# EasyEDA Pro project ProPrj_ftdi-jtag-xilinx-14pin_2025-03-20_v2.1.epro, board PCB1
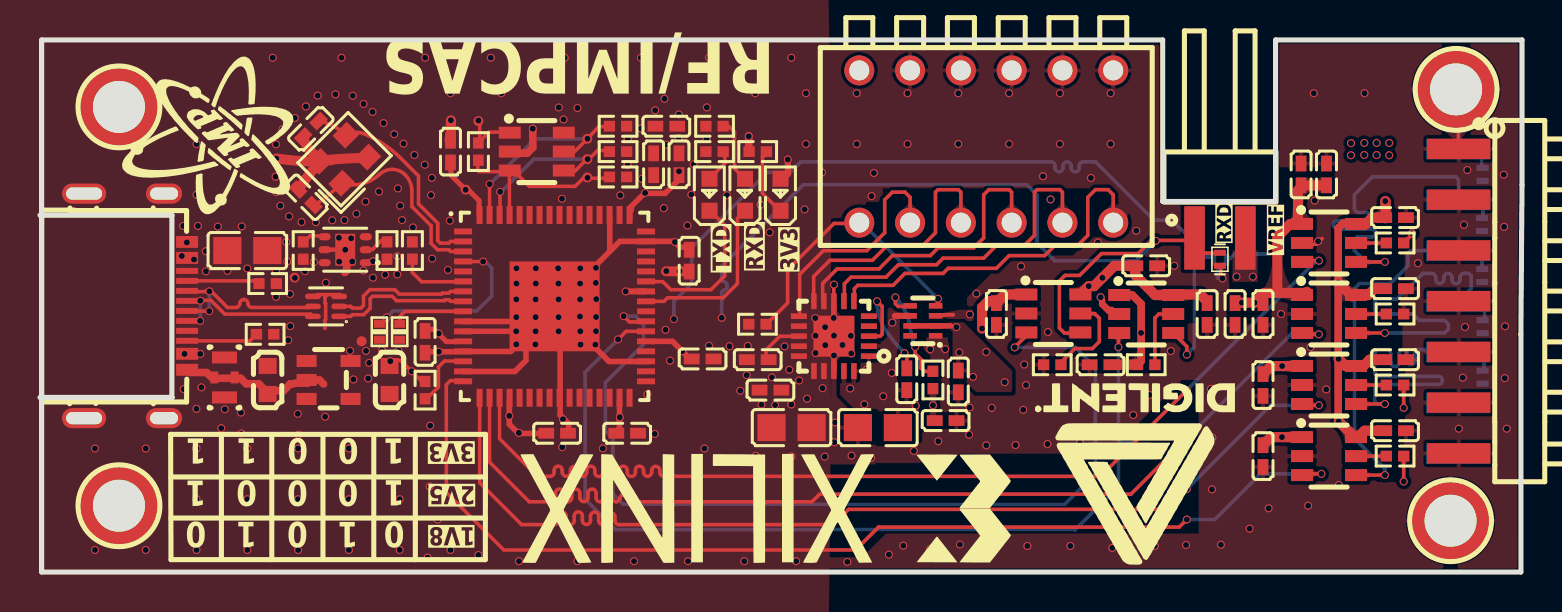
[diagram p4: board, top side]
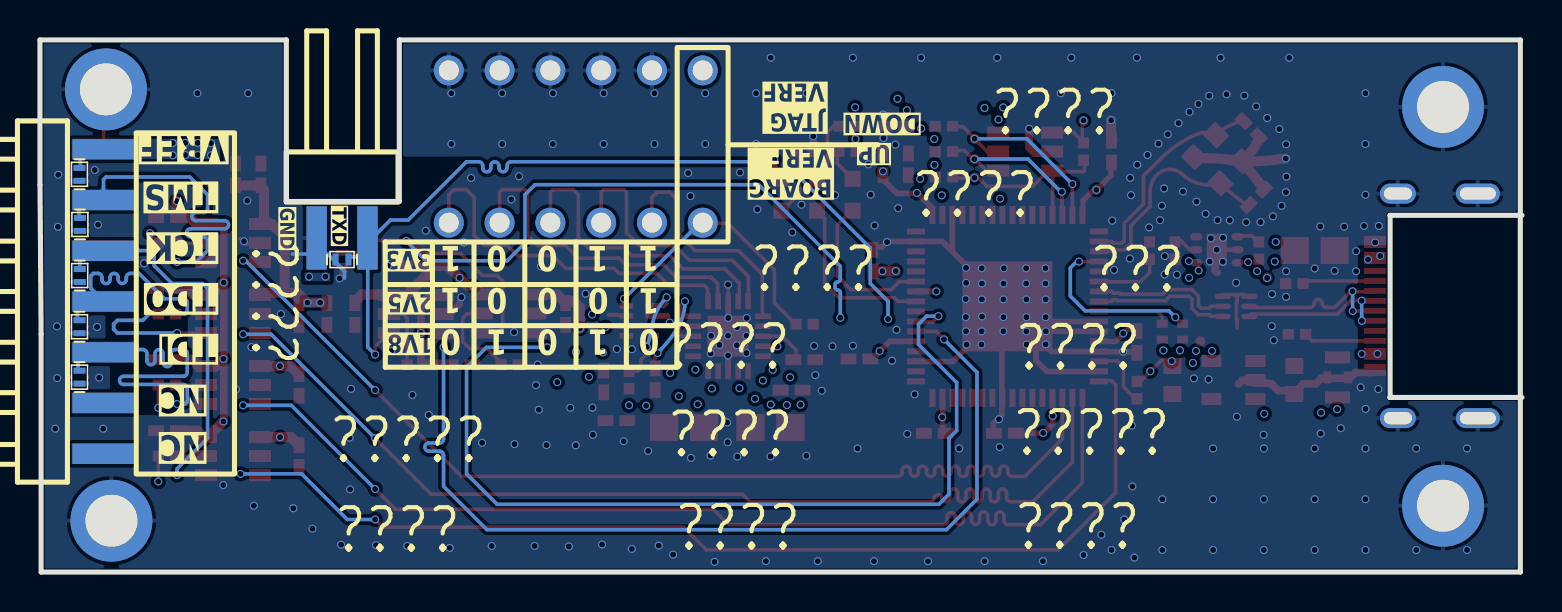
[diagram p5: board, bottom side, seen from below]

Outline 74.12 x 26.63 mm; copper layers: Top Layer, Inner1, Inner2, Bottom Layer. Coordinates in mm from the lower left corner of the outline.
Outline path: 0.08,26.63 56.15,26.63 56.15,18.55 61.8,18.55 61.8,26.63 74.12,26.63 74.12,19.38 74.07,11.9 74.07,0 0.08,0 0.08,26.63
Stack: Top Layer 0.035mm 外层铜厚1oz / Dielectric1 0.2104mm 7628 RC49% 8.6mil / Inner1 0.0152mm 内层铜厚 / Dielectric2 1.065mm 1.1mm H/HOZ Copper / Inner2 0.0152mm 内层铜厚 / Dielectric3 0.2104mm 7628 RC49% 8.6mil / Bottom Layer 0.035mm 外层铜厚1oz

## Design rules (mm)
net USB_DP_O: USB2
net USB_DN_O: USB2
net USB_DN: USB1
net USB_DP: USB1
net OSCO: OSC
net OSCI: OSC
template: 自定义配置
spacing copperThickness1oz (default): track to track 0.102, other pairs 0.152 to 0.3
spacing copperThickness2oz: track to track 0.203, other pairs 0.152 to 0.3
track width copperThickness1oz (default): min 0.127, default 0.178, max 2.54
track width copperThickness2oz: min 0.203, default 0.254, max 2.54
differential pair differentialPair (default): width min 0.127, default 0.254, max 2.54; gap min 0.152, default 0.152
via viaSize (default): diameter min 0.4, default 0.4, max 10; hole min 0.3, default 0.3, max 6.299

## Placement (name value [footprint] x y rotation side)
C1  100nF  [C0402]  25.87 6.95 180 top
C2  100nF  [C0402]  29.37 6.95 180 top
C3  100nF  [C0402]  32.47 15.58 270 top
C4  100nF  [C0402]  30.69 20.41 270 top
C5  100nF  [C0402]  59.77 12.92 90 top
C6  100nF  [C0402]  64.35 19.9 270 top
C7  100nF  [C0402]  55.33 15.33 180 top
C8  100nF  [C0402]  47.84 12.92 90 top
C9  100nF  [C0402]  31.96 20.41 270 top
C10  100nF  [C0402]  33.14 10.67 180 top
C11  100nF  [C0402]  20.53 21.04 270 top
C12  10uF  [C0603]  11.39 9.61 270 top
C13  4.7uF  [C0402]  19.26 11.52 270 top
C14  100nF  [C0402]  31.33 22.31 180 top
C15  NFM21PC104R1E3D  [CAP-SMD_4P-L2.0-W1.25]  9.23 9.74 270 top
C16  10uF  [C0603]  17.48 9.61 90 top
C17  22uF  [C0805]  10.37 16.09 0 top
C23  22uF  [C0805]  37.59 7.23 180 top
C24  100nF  [C0402]  36.53 9.11 180 top
C25  22uF  [C0805]  41.91 7.23 180 top
C26  100nF  [C0402]  61.17 12.92 90 top
C27  100nF  [C0402]  45.3 7.58 180 top
C28  100nF  [C0402]  67.78 17.74 180 top
C29  100nF  [C0402]  45.93 9.54 90 top
C30  10nF  [C0402]  35.9 10.63 180 top
C31  10nF  [C0402]  43.35 9.65 90 top
C32  100nF  [C0402]  61.17 9.36 90 top
C33  100nF  [C0402]  58.38 12.92 90 top
C34  100nF  [C0402]  53.04 10.38 0 top
C35  100nF  [C0402]  67.78 7.07 180 top
C36  100nF  [C0402]  63.08 19.9 270 top
C37  100nF  [C0402]  67.78 14.19 180 top
C38  100nF  [C0402]  61.17 5.8 90 top
C39  100nF  [C0402]  67.78 10.63 180 top
C40  10pF  [C0402]  13.55 22.19 45 top
C41  10pF  [C0402]  13.29 18.76 315 top
D1  H5VL10B  [SOD-882_L1.0-W0.6-BI]  72.15 19.91 90 bottom
D2  H5VL10B  [SOD-882_L1.0-W0.6-BI]  72.13 17.4 90 bottom
D3  H5VL10B  [SOD-882_L1.0-W0.6-BI]  72.14 14.84 90 bottom
D4  H5VL10B  [SOD-882_L1.0-W0.6-BI]  72.15 12.28 90 bottom
D5  H5VL10B  [SOD-882_L1.0-W0.6-BI]  72.15 9.76 90 bottom
D6  H5VL10B  [SOD-882_L1.0-W0.6-BI]  59.02 15.64 180 bottom
D7  H5VL10B  [SOD-882_L1.0-W0.6-BI]  59.02 15.65 90 top
L1  ECMF02-2AMX6  [UFQFN-6_L1.7-W1.5]  14.31 13.3 180 top
L2  BLM15PD121SN1D  [L0402]  17.99 12.03 270 top
L3  BLM15PD121SN1D  [L0402]  16.98 12.03 90 top
LED1  NCD0603Y1  [LED0603-RD]  37.04 18.88 90 top
LED2  NCD0603Y1  [LED0603-RD]  35.26 18.88 90 top
LED3  NCD0603Y1  [LED0603-RD]  33.49 18.88 90 top
R1  5.1kΩ  [R0402]  11.26 11.9 180 top
R2  5.1kΩ  [R0402]  11.39 14.44 180 top
R3  10kΩ  [R0402]  35.9 21.04 0 top
R4  10kΩ  [R0402]  33.74 22.31 180 top
R6  56kΩ  [R0402]  17.36 16.09 270 top
R10  10kΩ  [R0402]  28.91 22.31 180 top
R11  10kΩ  [R0402]  28.91 21.04 180 top
R12  200kΩ  [R0402]  13.17 16.09 270 top
R13  10kΩ  [R0402]  33.74 21.04 0 top
R14  12kΩ  [R0402]  18.63 16.09 270 top
R15  1kΩ  [R0402]  19.26 9.11 270 top
R18  2kΩ  [R0402]  21.93 21.04 270 top
R19  10kΩ  [R0402]  28.91 19.77 0 top
R20  10kΩ  [R0402]  44.66 9.61 90 top
R21  10kΩ  [R0402]  35.88 12.4 0 top
R22  10kΩ  [R0402]  67.78 5.8 0 top
R23  10kΩ  [R0402]  67.78 9.36 0 top
R24  10kΩ  [R0402]  67.78 12.92 0 top
R25  10kΩ  [R0402]  67.78 16.47 0 top
R26  10kΩ  [R0402]  55.33 10.38 180 top
R27  10kΩ  [R0402]  50.63 10.38 180 top
SW1  SMQP-06B-TP  [SW-TH_12P-P2.54_SMQP-06B-TP]  47.33 21.3 180 top
TP1  -  [Test-Point-0.5mm]  21.29 19.14 0 top
TP2  -  [Test-Point-0.5mm]  12.73 14.74 270 top
TP3  -  [Test-Point-0.5mm]  16.09 11.55 0 top
TP4  -  [Test-Point-0.5mm]  27.37 21.69 0 top
TP5  -  [Test-Point-0.5mm]  27.37 20.67 0 top
TP6  -  [Test-Point-0.5mm]  21.93 22.57 0 top
TP9  -  [Test-Point-0.5mm]  27.37 19.75 0 top
U1  -  [JTAG_V3]  71.08 13.55 0 top
U2  FT2232HQ-REEL  [QFN-64_L9.0-W9.0-P0.50-TL-EP4.3]  25.74 13.3 0 top
U3  -  [2x2p侧贴排针]  59.02 16.72 90 top
U4  TPS25200DRVR  [WSON-6_L2.0-W2.0-P0.65-TL-EP]  15.27 16.13 180 top
U5  TPS7A2033PDBVR  [SOT-23-5_L2.9-W1.6-P0.95-LS2.8-BR]  14.44 9.61 180 top
U6  93LC56BT-I/OT  [SOT-23-6_L2.9-W1.6-P0.95-LS2.8-BR]  24.85 21.04 180 top
U11  TPS7A8300RGRR  [VQFN-20_L3.5-W3.5-P0.50-BL-EP2.0]  39.71 11.81 90 top
U12  -  [M2焊接螺柱]  3.95 23.28 0 top
U13  -  [M2焊接螺柱]  70.55 2.57 90 top
U14  -  [M2焊接螺柱]  3.95 3.32 0 top
U15  -  [M2焊接螺柱]  70.83 24.16 90 top
U16  TPS2116DRLR  [SOT-583-8_L2.1-W1.6-P0.50-LS1.6-BL]  44.16 12.57 90 top
U22  SN74LVC1T45DBVR  [SOT-23-6_L2.9-W1.6-P0.95-LS2.8-BR]  64.47 5.8 180 top
U23  SN74LVC1T45DBVR  [SOT-23-6_L2.9-W1.6-P0.95-LS2.8-BR]  64.47 9.36 180 top
U24  SN74LVC1T45DBVR  [SOT-23-6_L2.9-W1.6-P0.95-LS2.8-BR]  64.47 12.92 180 top
U25  SN74LVC1T45DBVR  [SOT-23-6_L2.9-W1.6-P0.95-LS2.8-BR]  64.47 16.47 180 top
U26  SN74LVC1T45DBVR  [SOT-23-6_L2.9-W1.6-P0.95-LS2.8-BR]  55.33 12.92 180 top
U27  SN74LVC1T45DBVR  [SOT-23-6_L2.9-W1.6-P0.95-LS2.8-BR]  50.69 12.94 180 top
USB1  TYPEC-302-BRP16SC16  [USB-C-SMD_TYPEC-302-BRP16SC16]  4.78 13.32 270 top
X1  12MHz  [CRYSTAL-SMD_4P-L2.5-W2.0-BL-A]  15.2 20.66 45 top

## Footprints (pads in the part's own frame, mm; a bottom-side part is the same pattern mirrored in y, then rotated)
2x2p侧贴排针
  rect 3.17x1.02 smd: 1(0,1.27) 3(0,-1.27)
  rect 3.17x1.02 smd far side: 2(0,1.27) 4(0,-1.27)
C0402
  rect 0.79x0.54 smd: 1(-0.545,0) 2(0.545,0)
C0603
  rect 0.8x0.9 smd: 1(-0.7,0) 2(0.7,0)
C0805
  rect 1.41x1.35 smd: 1(-1,0) 2(1,0)
CAP-SMD_4P-L2.0-W1.25
  rect 0.6x1.25 smd: 1(-1,0) 3(1,0)
  rect 0.6x0.4 smd: 2(0,-0.508) 4(0,0.508)
CRYSTAL-SMD_4P-L2.5-W2.0-BL-A
  rect 1x0.9 smd: 1(-0.925,-0.775) 2(0.925,-0.775) 3(0.925,0.775) 4(-0.925,0.775)
JTAG_V3
  rect 3.17x1.02 smd: 1(-0.114,7.63) 3(-0.114,5.09) 5(-0.114,2.55) 7(-0.114,0.01) 9(-0.114,-2.53) 11(-0.114,-5.07) 13(-0.114,-7.61)
  rect 3.17x1.02 smd far side: 2(-0.158,7.606) 4(-0.158,5.066) 6(-0.158,2.526) 8(-0.158,-0.014) 10(-0.158,-2.554) 12(-0.158,-5.094) 14(-0.158,-7.634)
L0402
  rect 0.4x0.55 smd: 1(-0.4,0) 2(0.4,0)
LED0603-RD
  rect 0.8x0.8 smd: 1(-0.799,0) 2(0.799,0)
M2焊接螺柱
  round 4.1 hole 2.6: 1(0,0)
QFN-64_L9.0-W9.0-P0.50-TL-EP4.3
  rect 0.9x0.3 smd: 1(-4.575,3.75) 2(-4.575,3.25) 3(-4.575,2.75) 4(-4.575,2.25) 5(-4.575,1.75) 6(-4.575,1.25) 7(-4.575,0.75) 8(-4.575,0.25) 9(-4.575,-0.25) 10(-4.575,-0.75) 11(-4.575,-1.25) 12(-4.575,-1.75) 13(-4.575,-2.25) 14(-4.575,-2.75) 15(-4.575,-3.25) 16(-4.575,-3.75) 33(4.575,-3.75) 34(4.575,-3.25) 35(4.575,-2.75) 36(4.575,-2.25) 37(4.575,-1.75) 38(4.575,-1.25) 39(4.575,-0.75) 40(4.575,-0.25) 41(4.575,0.25) 42(4.575,0.75) 43(4.575,1.25) 44(4.575,1.75) 45(4.575,2.25) 46(4.575,2.75) 47(4.575,3.25) 48(4.575,3.75)
  rect 0.3x0.9 smd: 17(-3.75,-4.575) 18(-3.25,-4.575) 19(-2.75,-4.575) 20(-2.25,-4.575) 21(-1.75,-4.575) 22(-1.25,-4.575) 23(-0.75,-4.575) 24(-0.25,-4.575) 25(0.25,-4.575) 26(0.75,-4.575) 27(1.25,-4.575) 28(1.75,-4.575) 29(2.25,-4.575) 30(2.75,-4.575) 31(3.25,-4.575) 32(3.75,-4.575) 49(3.75,4.575) 50(3.25,4.575) 51(2.75,4.575) 52(2.25,4.575) 53(1.75,4.575) 54(1.25,4.575) 55(0.75,4.575) 56(0.25,4.575) 57(-0.25,4.575) 58(-0.75,4.575) 59(-1.25,4.575) 60(-1.75,4.575) 61(-2.25,4.575) 62(-2.75,4.575) 63(-3.25,4.575) 64(-3.75,4.575)
  rect 4.5x4.5 smd: 65(0,-0.001)
R0402
  rect 0.566x0.54 smd: 1(-0.433,0) 2(0.433,0)
SOD-882_L1.0-W0.6-BI
  rect 0.3x0.6 smd: 1(-0.325,0) 2(0.325,0)
SOT-23-5_L2.9-W1.6-P0.95-LS2.8-BR
  rect 1x0.6 smd: 1(1.1,-0.95) 2(1.1,0) 3(1.1,0.95) 4(-1.1,0.95) 5(-1.1,-0.95)
SOT-23-6_L2.9-W1.6-P0.95-LS2.8-BR
  rect 1.1x0.6 smd: 1(1.35,-0.95) 2(1.35,0) 3(1.35,0.95) 4(-1.35,0.95) 5(-1.35,0) 6(-1.35,-0.95)
SOT-583-8_L2.1-W1.6-P0.50-LS1.6-BL
  rect 0.28x0.68 smd: 1(-0.75,-0.64) 2(-0.25,-0.64) 3(0.25,-0.64) 4(0.75,-0.64) 5(0.75,0.64) 6(0.25,0.64) 7(-0.25,0.64) 8(-0.75,0.64)
SW-TH_12P-P2.54_SMQP-06B-TP
  round 1.5 hole 1: 1(-6.35,-3.81) 2(-3.81,-3.81) 3(-1.27,-3.81) 4(1.27,-3.81) 5(3.81,-3.81) 6(6.35,-3.81) 7(6.35,3.81) 8(3.81,3.81) 9(1.27,3.81) 10(-1.27,3.81) 11(-3.81,3.81) 12(-6.35,3.81)
Test-Point-0.5mm
  round 0.5 smd: 1(0,0)
UFQFN-6_L1.7-W1.5
  oval 0.79x0.28 smd: 1(-0.657,0.5) 2(-0.657,0) 3(-0.657,-0.5) 4(0.657,-0.5) 5(0.657,0) 6(0.657,0.5)
USB-C-SMD_TYPEC-302-BRP16SC16
  rect 0.6x1.1 smd: 1(-3.2,2.575) 2(-2.4,2.575) 11(2.4,2.575) 12(3.2,2.575)
  rect 0.3x1.1 smd: 3(-1.75,2.575) 4(-1.25,2.575) 5(-0.75,2.575) 6(-0.25,2.575) 7(0.25,2.575) 8(0.75,2.575) 9(1.25,2.575) 10(1.75,2.575)
  oval 1x1.8 hole 0.61x1.4: 13(-5.62,1.425) 14(5.62,1.425)
  oval 1x2.2 hole 0.61x1.8: 15(-5.62,-2.575) 16(5.62,-2.575)
VQFN-20_L3.5-W3.5-P0.50-BL-EP2.0
  rect 0.28x0.8 smd: 1(-1.001,-1.751) 2(-0.501,-1.751) 3(-0.001,-1.751) 4(0.499,-1.751) 5(1,-1.749) 11(0.999,1.749) 12(0.501,1.751) 13(-0.001,1.749) 14(-0.501,1.749) 15(-1.001,1.749)
  rect 0.8x0.28 smd: 6(1.75,-0.999) 7(1.75,-0.499) 8(1.75,0.001) 9(1.75,0.501) 10(1.75,1.001) 16(-1.75,0.999) 17(-1.75,0.499) 18(-1.75,-0.001) 19(-1.75,-0.501) 20(-1.75,-1.001)
  rect 2.05x2.05 smd: 21(-0.001,-0.001)
WSON-6_L2.0-W2.0-P0.65-TL-EP
  oval 0.607x0.364 smd: 1(-1.028,0.65) 2(-1.028,0) 3(-1.028,-0.65) 4(1.028,-0.65) 5(1.028,0) 6(1.028,0.65)
  rect 1x1.6 smd: 7(0,0)

## Nets
As in the schematic.

Pads without a net: U1 12 14; U2 21 22 23 24 26 27 28 29 30 32 33 34 36 40 44 45 46 48 52 53 54 55 57 58 59 60; U4 3; U5 4; U11 4 5 12; U16 8; USB1 3 9

## Via types
v1: diameter 0.4, hole 0.3, Top Layer to Bottom Layer, 403 vias

## Routing (per net, layer and track width the routed paths; a pad name or vN(x,y) marks a point on that pad's centre or on a via; arc(x,y) is an arc through that point)
3V3: length 37.9
  Top Layer w0.178: 19.14,9.49 18.04,10.59 17.74,10.59 ; R22.2 v1(68.21,4.53) ; R25.2 68.63,16.89 v1(68.63,16.96) ; R23.2 v1(68.21,8.22)
  Top Layer w0.28: 23.47,8.56 v1(23.47,7.82) 23.47,7.4 23.93,6.94 25.2,6.94 ; 28.71,6.92 28.98,7.19 28.98,8.58
  Top Layer w0.3: U2.42 v1(29.29,14.05)
  Top Layer w0.305: v1(37.4,20.65) 37.4,19.91 37.04,19.54
  Top Layer w0.381: 54.92,10.4 55.08,10.55 55.08,13.42 54.63,13.87 U26.1
  Top Layer w0.5: 62.92,17.42 62.53,17.42 61.89,16.77 61.89,14.11 ; 62.92,17.42 62.92,19.11 63.16,19.35 64.28,19.35 64.32,19.39 ; 62.92,17.42 62.92,17.38 ; 32.46,15.05 31.31,15.05 ; 63.38,14.02 63.32,13.97 61.24,13.97 v1(60.75,13.48) v1(60.12,13.48) 59.8,13.48 59.78,13.49
  Top Layer w0.508: C32.2 61.58,10.31 v1(62.13,10.31) U23.1 ; 54.92,10.4 54.78,10.38 53.53,10.38 ; U27.1 48.27,13.89 C8.2 ; 63.12,6.75 v1(62.12,6.75) 61.58,6.75 C38.2 ; 47.89,13.57 47.44,13.57 47.12,13.25 v1(47.12,12.19)
  vias: v1(15.51,11.07) v1(16.31,11.07) v1(16.46,10.47) v1(17.11,11.1) v1(17.52,10.56) v1(17.94,11.09) v1(18.59,10.05) v1(23.95,6.97) v1(25.95,23.26) v1(26.11,18.68) v1(26.19,22.65) v1(26.88,23.23) v1(29.02,18.86) v1(29,7.75) v1(29.4,21.67) v1(29.39,20.38) v1(30.05,22.2) v1(30.1,19.68) v1(30.77,23.11) v1(31.23,23.69) v1(31.33,15.06) v1(31.99,15.06) v1(33.35,23.26) v1(33.34,21.67) v1(44.66,8.35) v1(55.07,11.97)
+5V:
  vias: v1(9.25,8.15) v1(10.05,7.98) v1(12.89,7.92) v1(16.17,15.09) v1(16.66,15.56) v1(16.65,14.73) v1(36.09,8.38) v1(36.61,9.75) v1(36.77,8.36) v1(37.24,11.3) v1(37.48,10.12) v1(37.58,8.39) v1(37.97,9.59) v1(38.36,8.67) v1(39.14,9.2)
GND: length 67.2
  Top Layer w0.178: 14.25,12.19 14.25,12.61 14.29,12.64 14.29,13.45 14.25,13.49 14.25,13.76 14.37,13.88 ; 53.55,13.13 53.42,13 53.05,13.37 53.05,13.75 ; 59.11,14.68 59.06,14.73 59.06,15.34 ; 70.94,21.21 70.94,23.12 ; v1(39.71,14.39) 39.7,14.38 39.71,13.33 ; 53.67,12.91 53.67,13.14 53.62,13.19 53.47,13.19 53.19,13.47 53.19,13.62 53.05,13.75 ; 13.72,13.75 13.87,13.89 14.99,13.89 15.03,13.84 ; 53.05,13.75 53.05,13.77 ; 64.13,16.7 63.84,16.41 63.07,16.41
  Top Layer w0.229: 14.86,16.12 14.85,16.14 14.38,16.14
  Top Layer w0.28: 23.74,11.23 23.54,11.04 21.08,11.04 ; 20.91,11.03 v1(19.95,11.03) 19.3,11.03 ; 39.77,11.98 39.71,11.92 39.71,10.13 ; 21.16,10.04 23.75,10.04 24.31,10.59 24.31,11.3 24.32,11.31 ; 32.37,16.27 32.01,16.27 31.73,16.55 29,16.55 28.5,16.05 28.5,17.74 ; 27.54,11.46 28.46,10.54 30.45,10.54 ; 21.16,12.05 23.89,12.05 24.01,12.16 ; 25.79,11.29 26.02,11.07 26.02,7.85 26.44,7.42 26.44,6.93 ; 28.44,15.99 27.7,15.25 ; 21.16,12.54 23.71,12.54 ; 39.71,11.98 39.71,13.33
  Top Layer w0.381: 12.59,9.42 12.53,9.42 12.18,9.08 11.34,9.08 ; 14.18,9.41 13.98,9.61 13.48,9.61 ; 13.51,9.57 13.4,9.45 12.83,9.45 arc(12.73,9.44) 12.63,9.41 12.6,9.41 ; 11.52,8.84 10.94,9.42 10.31,9.42 10.04,9.7 9.64,9.7 ; v1(24.65,22.19) 24.65,21.24 24.37,20.97 23.47,20.97 ; 8.62,9.7 8.33,9.99 7.47,9.99 ; 9.64,9.7 8.73,9.7 ; 9.64,9.7 9.67,9.73 ; 15.25,14.99 15.35,15.09 15.35,15.88 ; 35.45,21 35.45,21.83
  Top Layer w0.5: 14.35,20.62 arc(13.57,21.02) 13.18,21.81 ; 14.35,20.62 arc(14.46,20.61) 14.57,20.61 ; 14.35,20.62 arc(15.35,20.7) 16.35,20.72 ; 14.03,20.55 arc(13.45,19.88) 12.94,19.15 ; 13.99,20.54 arc(12.91,20.58) 11.84,20.7
  Top Layer w0.508: 20.49,21.61 20.55,21.68 20.55,22.61
  Bottom Layer w0.178: 59.36,15.54 59.09,15.26 59.09,15.24 ; 59.36,15.54 59.36,15.64 ; 59.36,15.54 59.36,15.48 ; 59.36,15.54 59.74,15.92 61.5,15.92 ; 58.89,14.7 58.89,15.06 58.92,15.1 58.94,15.1 59.09,15.24 ; 59.09,15.24 59.34,15.5
  vias: v1(2.75,6.19) v1(2.75,1.11) v1(5.29,6.19) v1(5.29,1.11) v1(7.16,17.32) v1(7.19,9.16) v1(7.35,16.5) v1(7.83,23.97) v1(7.83,21.42) v1(7.83,18.88) v1(7.83,8.17) v1(7.83,6.19) v1(7.83,3.64) v1(7.83,1.11) v1(7.9,17.32) v1(8.07,9.25) v1(8.3,16.06) v1(8.3,15.05) v1(8.9,17.29) v1(9.07,7.2) v1(9.37,15.08) v1(10.09,17.3) v1(10.07,6.93) v1(10.37,15.19) v1(10.37,6.19) v1(10.37,3.64) v1(10.37,1.11) v1(11.64,25.74) v1(11.8,21.41) v1(11.81,20.69) v1(11.78,19.79) v1(11.81,19.02) v1(11.8,15.06) v1(11.8,13.77) v1(12.02,18.33) v1(12.13,22.17) v1(12.42,11.6) v1(12.46,17.8) v1(12.51,13.91) v1(12.52,12.31) v1(12.75,22.73) v1(12.92,6.87) v1(12.91,6.19) v1(12.91,3.64) v1(12.91,1.11) v1(13.08,17.52) v1(13.3,23.31) v1(13.8,17.51) v1(13.89,23.85) v1(14.3,14.48) v1(14.26,7.78) v1(14.62,17.61) v1(14.78,23.91) v1(14.95,16.73) v1(14.96,15.53) v1(15.08,25.74) v1(15.23,17.61) v1(15.27,16.13) v1(15.45,6.19) v1(15.45,3.64) v1(15.45,1.11) v1(15.56,16.71) v1(15.62,15.54) v1(15.64,23.84) v1(15.68,9.64) v1(15.83,17.93) v1(16.19,23.43) v1(16.28,18.54) v1(16.41,9.69) v1(16.63,23.03) v1(16.96,19.04) v1(17.18,22.47) v1(17.26,14.88) v1(17.72,21.91) v1(17.9,19.2) v1(17.87,15.81) v1(17.87,14.9) v1(18.02,18.33) v1(17.99,3.64) v1(17.99,1.11) v1(18.11,17.61) v1(18.18,21.44) v1(18.73,20.87) v1(18.65,17.25) v1(19.26,25.74) v1(19.25,20.38) v1(19.39,0.72) v1(19.52,7.33) v1(19.49,4.29) v1(19.6,19.73) v1(19.56,18.87) v1(19.62,15.69) v1(19.9,2.63) v1(20.41,15.12) v1(20.53,23.97) v1(20.5,17.59) v1(20.53,1.11) v1(20.55,22.61) v1(21.04,1.87) v1(21.93,0.85) v1(22.55,25.74) v1(23.07,23.97) v1(23.83,15.2) v1(23.83,14.44) v1(23.82,13.65) v1(23.82,12.76) v1(23.82,12.05) v1(23.82,11.4) v1(23.96,0.55) v1(24.8,15.2) v1(24.8,14.44) v1(24.79,13.65) v1(24.79,12.76) v1(24.79,12.05) v1(24.78,11.39) v1(25.92,15.2) v1(25.93,14.44) v1(25.94,13.65) v1(25.94,12.76) v1(25.94,12.05) v1(26.12,6.25) v1(26.16,7.65) v1(26.25,25.74) v1(26.88,0.55) v1(27.03,15.2) v1(27.01,14.44) v1(27.01,13.65) v1(27.01,12.79) v1(27.03,12.05) v1(27.04,11.39) v1(27.81,15.22) v1(27.8,14.47) v1(27.82,13.66) v1(27.82,12.76) v1(27.81,12.05) v1(27.78,11.38) v1(28.15,6.19) v1(29.71,0.55) v1(30.06,25.74) v1(30.38,8.9) v1(30.75,6.91) v1(31.2,18.21) v1(31.29,12.12) v1(31.34,21.39) v1(31.51,10.58) v1(31.76,16.52) v1(31.95,22.9) v1(31.94,21.72) v1(32.38,17.35) v1(32.41,0.55) v1(32.58,18.89) v1(32.7,20.41) v1(33.23,6.19) v1(33.47,25.74) v1(33.46,11.33) v1(34.36,18.86) v1(34.49,11.3) v1(35.03,9.07) v1(35.22,0.55) v1(35.4,11.32) v1(35.34,9.86) v1(35.45,21.81) v1(35.77,23.97) v1(35.8,5.82) v1(36.04,18.38) v1(36.5,17) v1(37.58,25.74) v1(37.59,5.79) v1(37.82,0.55) v1(38.31,23.97) v1(38.31,21.42) v1(38.24,18.15) v1(38.78,12.71) v1(38.79,11.83) v1(38.79,10.96) v1(39.11,20) v1(39.27,12.26) v1(39.28,11.36) v1(39.25,5.78) v1(39.7,12.72) v1(39.71,11.83) v1(39.71,10.84) v1(39.73,6.5) v1(39.76,7.49) v1(40.14,11.36) v1(40.38,0.51) v1(40.56,11.82) v1(40.58,10.94) v1(40.59,5.83) v1(40.85,23.97) v1(40.85,21.42) v1(41.59,18.82) v1(41.56,5.71) v1(41.71,19.97) v1(42.46,0.87) v1(43.18,1.32) v1(43.39,23.97) v1(43.39,21.42) v1(43.71,6.06) v1(44.52,11.15) v1(44.53,1.16) v1(44.93,6.55) v1(45.27,11.16) v1(45.93,23.97) v1(45.93,21.42) v1(46.01,1.38) v1(46.49,8.23) v1(46.47,6.87) v1(46.83,13.93) v1(47.33,6.34) v1(47.6,8.22) v1(47.67,1.28) v1(48.47,23.97) v1(48.47,21.42) v1(48.79,6.36) v1(49.07,15.3) v1(49.23,10.39) v1(49.18,8.12) v1(49.32,9.36) v1(49.38,1.3) v1(50.17,19.81) v1(50.41,12.01) v1(50.39,6.41) v1(50.55,18.65) v1(51.01,23.97) v1(51.01,21.42) v1(51.53,1.3) v1(52.01,6.47) v1(52.56,19.72) v1(52.91,16.5) v1(53.05,13.76) v1(53.55,23.97) v1(53.55,21.42) v1(53.63,1.21) v1(54.68,7.86) v1(54.83,17.08) v1(55.5,8.86) v1(55.76,1.3) v1(56.56,11.06) v1(56.73,15.33) v1(57.32,1.35) v1(58.57,9.17) v1(58.62,4.14) v1(58.64,6.73) v1(59.06,1.37) v1(59.14,14.69) v1(60.5,2.17) v1(61.45,3.19) v1(62.07,12.91) v1(63.43,3.32) v1(63.55,11.26) v1(63.71,23.97) v1(63.76,18.59) v1(63.92,16.56) v1(64.33,9.14) v1(64.96,4.35) v1(66.25,23.97) v1(68.92,15.46) v1(70.96,7.18) v1(71.22,17.38) v1(71.16,9.73) v1(71.27,12.26) v1(71.39,20.12) v1(73.21,19.88) v1(73.23,17.28) v1(73.28,12.3) v1(73.26,9.71) v1(73.36,7.18)
VCCB: length 30.3
  Top Layer w0.28: 43.47,12.32 45.55,12.32
  Top Layer w0.381: 64.93,7.56 64.93,17.21 65.18,17.46 65.67,17.46
  Top Layer w0.508: U26.6 55.78,13.87 54.78,14.86 C7.2 53.74,15.33 v1(53.14,14.73) 52.72,14.31 v1(52.46,14.31) U27.6 ; U25.6 66.31,17.42 66.63,17.74 C28.2 ; v1(64.95,10.67) 65.31,10.31 66.1,10.31 66.19,10.31 66.5,10.63 C39.2 ; 65.62,13.8 64.94,14.48 v1(64.94,14.49) ; C35.2 66.25,7.07 65.93,6.75 ; 57.01,13.89 58.03,13.89 58.36,13.57 ; 65.79,6.7 64.96,7.54 ; 67.3,17.71 67.3,18.55 v1(67.28,18.57) ; U24.6 66.44,13.87 66.76,14.19 C37.2
  vias: v1(45.84,12.26) v1(45.98,10.99) v1(46.66,9.77) v1(47.32,11.01) v1(48.25,9.5) v1(64.96,7.54)
100MV: length 18.2
  Top Layer w0.178: SW1.12 53.68,18.88 53.42,19.14 52.79,19.14 52.41,18.76 52.41,16.85 51.9,16.34 50.76,16.34 50.25,15.84 48.47,15.84 47.84,15.2 45.42,15.2 45.17,14.95 43.26,14.95 42.67,14.35 40.9,14.35 40.73,14.18 40.73,13.59
200MV: length 16.6
  Top Layer w0.178: 51.15,17.39 51.2,17.39 ; 40.23,13.55 40.23,14.43 40.56,14.76 42.31,14.76 42.94,15.38 44.84,15.38 45.17,15.71 47.2,15.71 47.84,16.34 49.23,16.34 49.74,16.85 49.74,19.01 49.87,19.14 51.01,19.14 51.14,19.01 SW1.11
400MV: length 15
  Top Layer w0.178: 39.15,13.64 39.15,14.45 39.87,15.17 41.96,15.17 42.63,15.84 44.53,15.84 44.92,16.23 46.7,16.23 47.2,16.73 47.2,18.88 47.46,19.14 48.47,19.14 48.6,19.01 SW1.10
800MV: length 13.3
  Top Layer w0.178: SW1.9 46.06,19.01 45.93,19.14 44.91,19.14 44.79,19.01 44.79,16.98 44.15,16.34 42.38,16.34 41.63,15.6 39.5,15.6 38.69,14.79 38.69,13.39
1600MV: length 11.8
  Top Layer w0.178: SW1.8 43.52,18.76 43.26,19.01 42.63,19.01 42.25,18.63 42.25,16.98 41.35,16.08 39.18,16.08 37.99,14.89 ; 38.09,12.82 38,12.82 ; 38,12.82 38,14.89 ; 38,12.82 38,12.78
EE_CLK: length 8.6
  Top Layer w0.178: 26.24,20.07 26.75,20.07 27.29,20.61 ; 23.01,17.84 23.01,19.05 ; 28.37,21.1 27.89,21.1 27.45,20.66
  Bottom Layer w0.178: 23.07,19.04 24.7,20.67 v1(27.39,20.67)
  vias: v1(23.02,19.03)
EE_CS: length 10.3
  Top Layer w0.178: 27.36,21.67 27.94,22.29 28.28,22.29 ; 27.36,21.67 27.54,21.84 ; 27.36,21.67 26.66,20.97 26.04,20.97 ; 22.49,18.01 22.49,19.43
  Bottom Layer w0.178: 22.49,19.42 24.76,21.69 v1(27.38,21.69)
  vias: v1(22.49,19.42)
EE_DI: length 9.6
  Top Layer w0.178: 23.58,20.06 23.48,19.96 23.48,18 23.45,17.97 23.45,17.85 ; 23.62,20.04 23.73,20.04 24.47,19.3 26.76,19.3 27.23,19.77 27.37,19.77 ; 21.89,20.52 21.89,20.1 21.95,20.04 23.53,20.04 ; 28.4,19.77 28.33,19.71 27.42,19.71
  vias: v1(27.39,19.73)
EE_DO: length 2.7
  Top Layer w0.178: 22.02,21.59 22.45,22.02 23.53,22.02 ; 21.99,21.51 21.99,22.49 21.98,22.5
  vias: v1(21.93,22.6)
INT_VERF: length 0.8
  Top Layer w0.305: U16.6 42.76,12.82
  vias: v1(40.52,9.19) v1(41.23,8.4) v1(41.34,10.13) v1(42.18,8.8) v1(42.63,12.49) v1(42.61,9.97) v1(43.8,8.33)
JTAG_TCK: length 54
  Top Layer w0.178: v1(64.09,4.91) 63.18,4.91 U22.3 ; 21.27,9.58 20.53,9.58 20.32,9.37 20.33,3.98 23.2,1.11 40.79,1.11 41.94,2.25 56.98,2.25 v1(57.36,2.63)
  Bottom Layer w0.178: v1(57.36,2.63) 58.76,2.63 61.04,4.91 v1(64.09,4.91)
JTAG_TCK_O: length 18.5
  Top Layer w0.178: U22.4 v1(67.27,4.85)
  Bottom Layer w0.178: 72.22,15.87 72.13,15.78 72.13,15.14 ; v1(67.27,4.85) 67.27,5.17 65.74,6.69 65.74,14.19 66,14.44 67.52,14.44 68.41,15.33 68.41,15.96 68.54,16.09 70.91,16.09 U1.6
JTAG_TDI: length 54
  Top Layer w0.178: v1(57.36,4.15) 56.34,3.14 40.44,3.14 39.68,2.38 28.96,2.38 arc(28.81,2.43) 28.75,2.58 28.75,2.77 arc(28.55,2.97) 28.35,2.77 28.35,2.58 arc(28.14,2.38) 27.94,2.58 27.94,2.81 arc(27.74,3.01) 27.53,2.81 27.53,2.58 arc(27.33,2.38) 27.13,2.58 27.13,2.81 arc(26.93,3.01) 26.72,2.81 26.72,2.58 arc(26.52,2.37) 26.31,2.58 26.31,2.81 arc(26.11,3.01) 25.91,2.81 25.91,2.58 arc(25.85,2.43) 25.71,2.38 24.09,2.38 21.99,4.47 21.99,8.63 ; v1(63.97,8.34) 63.19,8.34 U23.3
  Bottom Layer w0.178: v1(57.36,4.15) 61.55,8.34 v1(63.97,8.34)
JTAG_TDI_O: length 18.4
  Top Layer w0.178: U23.4 v1(67.27,8.41)
  Bottom Layer w0.178: 72.22,10.14 72.22,10.8 72.23,10.81 ; v1(67.27,8.41) 66.88,8.41 66.76,8.54 66.76,9.19 arc(66.82,9.33) 66.96,9.39 69.94,9.39 arc(70.15,9.59) 69.94,9.8 66.96,9.8 arc(66.82,9.86) 66.76,10 66.76,11.01 66.88,11.14 67.36,11.14 arc(67.5,11.08) 67.56,10.93 67.56,10.49 arc(67.76,10.28) 67.97,10.49 67.97,10.93 arc(68.17,11.14) 68.37,10.93 68.37,10.57 arc(68.58,10.37) 68.78,10.57 68.78,10.93 arc(68.84,11.08) 68.98,11.14 70.78,11.14 U1.10
JTAG_TDO: length 54
  Top Layer w0.178: v1(63.97,11.9) 63.19,11.9 U24.3 ; U2.18 22.49,5.5 24.47,3.52 25.58,3.52 arc(25.72,3.58) 25.78,3.72 25.78,3.95 arc(25.99,4.15) 26.19,3.95 26.19,3.72 arc(26.39,3.52) 26.59,3.72 26.59,3.95 arc(26.8,4.15) 27,3.95 27,3.72 arc(27.2,3.52) 27.41,3.72 27.41,3.95 arc(27.61,4.15) 27.81,3.95 27.81,3.72 arc(28.02,3.52) 28.22,3.72 28.22,3.95 arc(28.42,4.15) 28.63,3.95 28.63,3.72 arc(28.69,3.58) 28.83,3.52 arc(28.96,3.57) 29.01,3.7 arc(29.06,3.82) 29.19,3.87 29.24,3.87 arc(29.36,3.82) 29.41,3.7 arc(29.47,3.57) 29.59,3.52 38.61,3.52 38.99,3.9 54.57,3.9 v1(57.36,6.69)
  Bottom Layer w0.178: v1(63.97,11.9) 62.57,11.9 v1(57.36,6.69)
JTAG_TDO_O: length 18.4
  Top Layer w0.178: U24.4 v1(67.27,11.97)
  Bottom Layer w0.178: 72.14,12.62 72.26,12.73 72.26,13.22 ; v1(67.27,11.97) 70.25,11.97 70.44,12.15 70.44,12.41 70.25,12.6 68.98,12.6 68.66,12.92 66.89,12.92 66.76,13.04 66.76,13.55 66.89,13.68 67.9,13.68 69.17,14.95 69.6,14.95 arc(69.75,14.89) 69.81,14.74 69.81,14.64 arc(70.01,14.44) 70.21,14.64 70.21,14.74 arc(70.42,14.95) 70.62,14.74 70.62,14.64 arc(70.82,14.44) 71.03,14.64 71.03,14.74 arc(71.09,14.89) 71.23,14.95 71.46,14.95 71.58,14.82 71.58,14.2 U1.8
JTAG_TMS: length 53.8
  Top Layer w0.178: v1(63.97,15.58) 63.18,15.58 U25.3 ; U2.19 22.99,6.67 24.87,4.79 25.51,4.79 arc(25.66,4.85) 25.72,4.99 25.72,5.09 arc(25.92,5.3) 26.12,5.09 26.12,4.99 arc(26.33,4.79) 26.53,4.99 26.53,5.09 arc(26.73,5.3) 26.94,5.09 26.94,4.99 arc(27.14,4.79) 27.34,4.99 27.34,5.09 arc(27.55,5.3) 27.75,5.09 27.75,4.99 arc(27.95,4.79) 28.16,4.99 28.16,5.09 arc(28.36,5.3) 28.56,5.09 28.56,4.99 arc(28.77,4.79) 28.97,4.99 28.97,5.09 arc(29.17,5.3) 29.37,5.09 29.37,4.99 arc(29.58,4.79) 29.78,4.99 29.78,5.09 arc(29.98,5.3) 30.19,5.09 30.19,4.99 arc(30.39,4.79) 30.59,4.99 30.59,5.09 arc(30.8,5.3) 31,5.09 31,4.99 arc(31.06,4.85) 31.2,4.79 53.04,4.79 v1(57.36,9.11)
  Bottom Layer w0.178: v1(57.36,9.11) 63.84,15.58 v1(63.97,15.58)
JTAG_TMS_O: length 18.4
  Top Layer w0.178: U25.4 v1(67.27,15.52)
  Bottom Layer w0.178: 72.22,18.37 72.18,18.33 72.18,17.72 ; v1(67.27,15.52) 66.31,15.52 65.74,16.09 65.74,16.57 arc(65.8,16.72) 65.95,16.78 66.59,16.78 arc(66.79,16.98) 66.59,17.18 64.9,17.18 arc(64.69,17.39) 64.9,17.59 66.33,17.59 arc(66.53,17.79) 66.33,18 65.95,18 arc(65.8,18.06) 65.74,18.2 65.74,18.88 66.63,19.77 70.82,19.77 70.95,19.65 70.95,18.65 U1.4
JTAG_VREF: length 1.5
  Top Layer w0.178: 45.23,12.87 45.21,12.85 44.98,12.85 44.95,12.82 U16.3
  Top Layer w0.2: 45.23,12.87 45.68,12.87
  Bottom Layer w0.178: 72.13,20.88 72.11,20.85 72.11,20.3
  vias: v1(46.51,12.89) v1(59.85,14.78) v1(60.66,14.78) v1(65.57,21.47) v1(65.57,20.86) v1(66.24,21.48) v1(66.23,20.87) v1(66.86,21.48) v1(66.85,20.87) v1(67.48,21.48) v1(67.48,20.86)
OSCI: length 11
  Top Layer w0.178: U2.2 20.53,16.55 20.45,16.46 20.02,16.46 19.89,16.59 19.89,17.47 18.93,18.43 18.93,19.83 18.06,20.7 arc(17.2,21.41) 16.21,21.93 arc(15.75,22.01) X1.3 arc(14.67,22.33) C40.2
OSCO: length 10.6
  Top Layer w0.178: U2.3 20.53,16.05 20.45,16.13 19.88,16.13 19.56,16.45 19.56,17.33 18.6,18.29 18.6,19.06 arc(18.51,19.52) 18.25,19.9 arc(17.95,20.09) 17.61,20.16 arc(17.27,20.09) 16.98,19.9 arc(16.09,19.43) 15.09,19.46 arc(14.53,18.95) 13.93,18.5
UART_RXD: length 47.7
  Top Layer w0.178: 48.69,11.19 49.29,11.79 49.29,11.98 ; v1(29.19,12.81) 29.48,12.52 30.32,12.52
  Bottom Layer w0.178: v1(29.19,12.81) 29.78,12.81 30.18,12.41 30.18,11.39 28.28,9.49 28.28,7.07 28.66,6.69 28.66,3.9 29.17,3.39 51.27,3.39 52.79,4.91 52.79,10.25 51.79,11.24 v1(48.75,11.24)
UART_RXD_LED: length 8.7
  Top Layer w0.178: LED2.1 34.88,17.7 34.88,14.44 34.17,13.73 31.39,13.73 31.21,13.55 U2.41
UART_RXD_O: length 42.3
  Top Layer w0.178: 55.56,16.58 v1(55.81,16.58) ; 55.56,16.58 54.92,15.94 53.09,15.94 52,14.85 51.27,14.85 50.99,14.56 50.99,12.21 51.24,11.96 52.04,11.96 ; 55.56,16.58 55.58,16.6 57.51,16.6 57.73,16.38 ; 57.96,16.02 58.02,15.96 59.08,15.96
  Bottom Layer w0.178: v1(34.09,12.73) 34.09,13.98 arc(34.13,14.08) 34.23,14.12 arc(34.32,14.16) 34.36,14.25 34.36,14.39 arc(34.32,14.48) 34.23,14.52 arc(34.13,14.56) 34.09,14.66 34.09,15.3 38.18,19.39 49.37,19.39 49.87,18.88 49.87,16.47 50.76,15.58 54.82,15.58 v1(55.81,16.58)
UART_TXD: length 47.7
  Top Layer w0.178: U2.38 29.31,12.05 v1(28.91,11.65) ; 53.94,11.97 v1(53.94,11.26)
  Bottom Layer w0.178: v1(53.94,11.26) 53.94,6.66 arc(54,6.51) 54.14,6.45 54.67,6.45 arc(54.88,6.25) 54.67,6.05 54.14,6.05 arc(54,5.99) 53.94,5.84 53.94,4.29 51.77,2.12 28.79,2.12 27.26,3.64 27.26,9.99 v1(28.91,11.65)
UART_TXD_LED: length 8.1
  Top Layer w0.178: 30.24,14.53 31.14,14.53 31.55,14.13 33.56,14.13 34.25,14.82 34.25,17.36 33.52,18.08 LED3.1
UART_TXD_O: length 41.9
  Top Layer w0.178: v1(57.36,10.88) 57.36,11.28 U26.4
  Bottom Layer w0.178: v1(57.36,10.88) 57.73,11.26 57.73,16 ; 58.71,15.77 57.84,15.77 57.73,15.88 ; v1(31.71,12.66) 31.71,13.55 32.6,14.44 32.6,16.22 36.38,20.01 37.53,20.01 38.06,20.54 50.56,20.54 arc(50.7,20.48) 50.76,20.33 50.76,20.23 arc(50.97,20.03) 51.17,20.23 51.17,20.33 arc(51.37,20.54) 51.58,20.33 51.58,20.23 arc(51.78,20.03) 51.98,20.23 51.98,20.33 arc(52.04,20.48) 52.19,20.54 52.79,20.54 55.71,17.61 56.6,17.61 57.73,16.48 57.73,16.08
USB_5V:
  vias: v1(7.09,15.82) v1(7.23,10.92) v1(7.7,15.64) v1(8.02,10.92) v1(12.32,16.52) v1(12.37,15.54) v1(12.75,14.72) v1(13.25,15.06) v1(13.7,15.51)
USB_CC1: length 3.7
  Top Layer w0.178: 7.36,14.57 10.82,14.57 R2.2
USB_CC2: length 3.6
  Top Layer w0.178: 7.36,11.57 10.5,11.57 R1.2
USB_DN: length 9.3
  Top Layer w0.178: 7.65,14.07 7.71,14.07 7.75,14.03 8.27,14.03 8.31,14.07 8.45,14.07 v1(8.48,14.05) 8.56,14.05 9.37,13.24 9.79,13.24 arc(9.93,13.3) 9.99,13.44 arc(10.05,13.58) 10.19,13.64 10.2,13.64 arc(10.34,13.58) 10.4,13.44 arc(10.46,13.3) 10.6,13.24 13.46,13.24 13.51,13.3 L1.5 ; v1(8.46,13.06) 7.37,13.06 7.36,13.07
  Top Layer w0.254: 7.65,14.07 7.36,14.07
  Bottom Layer w0.178: v1(8.46,13.06) 8.48,13.07 v1(8.48,14.05)
USB_DN_O: length 7
  Top Layer w0.178: L1.2 15.54,13.3 15.62,13.21 16.06,13.21 16.18,13.34 16.18,13.81 16.5,14.13 17.75,14.13 17.97,13.91 20.09,13.91 20.14,13.96 20.45,13.96 20.53,14.05 U2.7
USB_DP: length 7
  Top Layer w0.178: v1(8.02,13.58) 8.04,13.6 8.55,13.6 9.24,12.91 13.54,12.91 L1.6
  Bottom Layer w0.178: v1(8.02,13.58) 8.02,12.58 v1(8.01,12.57)
USB_DP_O: length 7
  Top Layer w0.178: L1.1 15.54,12.8 15.62,12.88 16.19,12.88 16.51,13.2 16.51,13.68 16.64,13.8 17.61,13.8 17.83,13.58 20.22,13.58 20.27,13.63 20.45,13.63 20.53,13.55 U2.8
VCORE: length 11.2
  Top Layer w0.254: 20.56,20.44 20.56,19.86 21.35,19.07 21.48,19.07 21.96,18.59 21.96,17.93 22.01,17.88 ; 19.29,12.12 19.33,12.15 19.71,12.15 20.33,11.53 20.83,11.53 20.84,11.55
  Top Layer w0.28: 32.59,10.59 31.63,11.55 30.65,11.55 ; 29.5,17.69 29.5,18.05 29.58,18.13 29.58,18.3 30.23,18.95 31.27,18.95 32.08,19.77
  vias: v1(19.95,11.94) v1(21.29,19.13) v1(30.27,18.98) v1(31.96,20.06) v1(32.13,11.06)
VREF_SEL: length 13.7
  Top Layer w0.178: 40.98,17.45 39.71,17.45 37.39,15.13 37.39,13.47 36.31,12.38 ; 44.82,13.31 44.91,13.41 v1(44.91,13.68)
  Bottom Layer w0.178: v1(44.91,13.68) 41.1,17.49 SW1.7
$1N3333: length 9.2
  Top Layer w0.178: 21.06,15.54 v1(22.16,15.54) ; v1(17.34,12.75) 17.34,12.72 16.98,12.36
  Bottom Layer w0.178: v1(17.34,12.75) 17.66,13.07 21.85,13.07 22.59,13.81 22.59,15.22 22.31,15.5 22.22,15.5
$1N3334: length 3.6
  Top Layer w0.178: L2.1 17.99,12.79 18.25,13.04 21.16,13.04 U2.9
$1N3341: length 3.2
  Top Layer w0.178: 18.62,15.67 18.62,15 19.09,14.53 20.94,14.53
$1N3343: length 3.1
  Top Layer w0.178: 19.26,8.67 19.33,8.67 19.93,9.26 19.93,10.26 20.23,10.57 21.01,10.57
$1N3498: length 5.5
  Top Layer w0.178: v1(43.77,11.27) 43.77,10.94 44.07,10.64 44.07,10.21 44.23,10.05 R20.2 ; 42.78,13.7 42.78,13.43 42.92,13.3 43.38,13.3
  Bottom Layer w0.178: 43.82,11.25 43.82,11.27 ; v1(43.77,11.27) arc(43.62,11.77) 43.52,12.28 arc(43.27,13.08) v1(42.78,13.75)
$1N3540: length 1.1
  Top Layer w0.178: 13.34,16.53 13.34,16.65 13.52,16.83 14.17,16.83 14.23,16.76
$1N3543: length 1.3
  Top Layer w0.178: 17.3,16.58 17.06,16.58 16.63,16.14 16.23,16.14
  Top Layer w0.305: 17.35,16.52 R6.1
$1N3571: length 2.3
  Top Layer w0.178: 37.8,11.8 37,11.8 36.31,11.12 36.31,10.6
$1N3574: length 6.3
  Top Layer w0.178: 43.36,10.15 43.36,10.84 v1(43.24,10.96) ; v1(41.87,13.55) 42.12,13.3 42.12,11.9 42.03,11.81 U11.3
  Bottom Layer w0.178: v1(43.24,10.96) arc(42.81,11.42) 42.43,11.92 arc(42.3,12.11) 42.17,12.31 arc(41.98,12.78) 41.88,13.28 arc(41.87,13.41) v1(41.87,13.55)
$1N4563: length 2.9
  Top Layer w0.178: 36.74,18.35 36.13,18.95 36.13,20.76 36.34,20.96
$1N7583: length 1.2
  Top Layer w0.178: 33.77,19.98 34.25,20.46 34.25,20.98
$1N18705: length 1.5
  Top Layer w0.178: R22.1 U22.5
$1N18713: length 1.5
  Top Layer w0.178: R23.1 U23.5
$1N18716: length 1.5
  Top Layer w0.178: R25.1 U25.5
$1N19227: length 3.3
  Top Layer w0.178: R26.1 55.76,12.71 55.96,12.92 U26.5
$1N19229: length 4.3
  Top Layer w0.178: 52.38,12.98 52.42,12.93 52.76,12.93 52.98,12.7 52.98,11.53 52.64,11.19 51.76,11.19 50.99,10.42
$1N19829: length 1.5
  Top Layer w0.178: R24.1 U24.5
$1N22625: length 2.9
  Top Layer w0.178: 34.25,22.37 34.39,22.37 34.74,22.02 34.74,20.19 35.01,19.92

## Copper pours and planes (outline as drawn; the poured copper is in the pictures)
3V3 on Top Layer: 25.67,23.19 26.75,23.19 26.75,21.87 25.67,21.87
3V3 on Top Layer: 25.67,23.47 30.99,23.47 30.99,22.93 25.67,22.93
3V3 on Top Layer: 25.83,22.58 31.19,22.58 31.19,18.05 25.83,18.05
3V3 on Top Layer: 30.39,23.98 33.62,23.98 33.62,20.77 30.39,20.77
3V3 on Top Layer: 15.03,11.91 18.34,11.91 18.34,9.9 15.03,9.9
3V3 on Inner2: 36.31,23.24 39.34,26.26 42.34,26.26 42.34,15.33 36.31,15.33
3V3 on Inner2: 66.81,17.7 66.2,17.09 66.2,2.87 69.59,2.87 69.59,17.68 69.57,17.7
3V3 on Inner2: 37.81,8.03 37.87,2.84 67.84,2.84 67.84,6.49 64.47,6.49 62.1,8.86 46.86,8.86 43.69,12.03 39.35,12.09 39.39,8.04
3V3 on Inner2: 14.78,11.58 14.78,9.41 17.94,6.25 30.17,6.25 31.46,7.76 31.49,11.24 37.85,18.61 37.85,24.71 25.46,24.71 25.46,19.54 25.48,19.51 25.48,17.58 26.34,16.73 28.62,16.73 29.2,17.31 29.2,18.69 29.96,19.45 30.59,19.45 30.61,19.43 30.89,19.43 31.39,19.93 31.39,20.2 31.73,20.54 32.71,20.54 32.79,20.62 33.39,20.02 31.12,16.76 25.51,9.79 20.6,9.79 18.81,11.58
3V3 on Inner2: 39.33,10.63 43.2,10.63 43.17,15.24 37.64,19.15 31.63,14.75 31.63,11.77 38.26,11.77 39.33,10.71
3V3 on Inner2: 59.28,14.02 63.55,14.02 63.55,11.8 59.28,11.8
3V3 on Inner2: 48.51,10.12 46.28,12.47 63.31,12.55 63.58,12.28 63.58,7.52 63.1,7.04 49.03,7.04 48.51,7.56
+5V on Top Layer: 15.99,15.74 16.85,15.74 16.85,14.53 15.99,14.53
+5V on Top Layer: 8.6,9.04 13.83,9.04 13.83,7.48 8.6,7.48
+5V on Top Layer: 38.34,11.44 37.11,11.44 37.11,10.5 35.84,9.22 35.84,6.52 37.84,6.52 37.87,6.56 37.87,8.02 38.05,8.2 38.75,8.2 39.39,8.85 39.39,10.61 39.35,10.65 38.59,10.65 38.53,10.71 38.53,11.45 38.35,11.45
+5V on Inner2: 8.4,9.67 12.28,9.67 17.03,4.92 30.74,4.92 33.13,7.31 33.13,10.74 33.9,11.51 38.4,11.51 38.57,11.34 38.57,10.8 38.79,10.57 39.38,10.57 39.44,10.51 39.44,8.82 38.62,8.01 37.95,8.01 37.83,7.89 37.83,2.85 8.4,2.85
+5V on Inner2: 8.4,10.34 12.1,14.03 12.7,14.03 14.91,16.24 17.09,16.24 17.09,14.07 16.61,13.9 13.81,13.44 13.8,13.45 13.58,13.34 13.54,13.21 13.22,12 13.22,9.54 13.12,8.69 12.58,8.69 8.4,8.69 8.4,8.69
GND on Top Layer: 20.87,16.89 20.4,16.89 20.17,17.12 20.17,17.65 19.27,18.55 19.27,19.84 19.27,19.85 19.27,19.91 15.61,23.58 13.94,23.58 12.12,21.76 12.12,18.71 13.04,17.8 15.11,17.8 17.02,19.71 17.98,19.71 18.28,19.42 18.28,18.04 19.33,16.98 19.33,16.34 19.82,15.85 20.42,15.85 20.49,15.78 20.49,15.38 20.68,15.19 20.75,15.19 20.93,15.01 21.05,15.01 21.05,14.91 21.04,14.9 20.41,14.9 20.05,15.25 19.73,15.25 19.32,15.66 19.32,15.82 18.9,16.24 18.34,16.24 18.08,16.5 18.08,17.26 17.71,17.63 17.71,18.58 17.48,18.81 17.04,18.81 15.51,17.28 12.48,17.28 11.47,18.29 11.47,21.83 13.77,24.12 15.92,24.12 19.78,20.26 19.78,18.85 20.81,17.83 20.81,17.4 21.03,17.19 21.03,17.05
GND on Top Layer: 15.73,15.07 15.73,13.75 15.49,13.51 11.74,13.51 11.52,13.73 11.52,15.27 11.52,15.28 11.99,15.28 12.11,15.16 12.11,14.97 12.26,14.81 12.26,14.57 12.5,14.34 13.13,14.34 13.58,14.79 14.14,14.79 14.65,15.29 14.65,15.72 14.83,15.91 15.73,15.91
GND on Top Layer: 19.96,7.71 19.96,3.54 22.76,0.74 41.12,0.74 42.3,1.92 74.06,1.92 74.07,0 17.96,0.05 17.96,7.71
GND on Top Layer: 30.82,21.49 42.39,21.49 42.39,14.84 30.82,14.84
GND on Top Layer: 45.73,5.93 46.36,6.56 46.36,13.72 48.47,15.84 51.65,15.84 54.36,18.55 61.8,18.55 61.8,26.63 74.12,26.63 74.12,0 57.96,0 57.96,9.53 57.87,9.61 57.11,9.61 53.42,5.93
GND on Top Layer: 17.11,15.95 18,15.95 18,14.75 17.11,14.75
GND on Top Layer: 10.37,26.38 56.09,26.38 56.22,26.5 56.22,18.05 40.92,18.05 37.97,21 35.45,21 35.45,21.75 34.95,22.25 34.95,23.64 34.12,24.47 25.87,24.47 25.48,24.09 25.48,22.09 24.85,21.46 24.37,21.93 24.21,21.93 24.21,22.69 23.71,23.2 21.8,23.2 21.17,22.57 21.17,22.29 20.55,21.68 17.25,24.98 10.12,24.98 10.12,26.12
GND on Top Layer: 0.03,26.63 10.45,26.63 10.45,17 0.03,17
GND on Top Layer: 6.65,17.63 10.44,17.63 10.44,15.88 6.65,15.88
GND on Top Layer: 25.87,7.85 25.87,6.15 26.63,5.39 41.81,5.39 41.81,7.79 41.38,8.22 40.61,8.22 40.17,8.66 40.17,8.77 40,8.94 40,10.45 39.85,10.61 39.45,10.61 39.45,9.71 39.36,9.62 38.57,9.62 38.74,9.46 39.46,9.46 39.46,8.66 38.83,8.03 38.07,8.03 37.94,7.91 37.83,7.91 37.83,6.63 37.63,6.44 35.82,6.44 35.47,6.79 35.47,8.48 35.82,8.84 36.43,8.84 36.49,8.89 36.49,9.29 36.26,9.52 36.26,9.54 35.91,9.89 35.91,11.11 36.24,11.44 36.24,12.4 37.74,13.89 37.74,15.35 37.5,15.58 36.62,15.58 36.24,15.2 35.27,15.2 35.09,15.02 35.09,14.39 34.19,13.49 30.01,13.53 30.05,8.05 29.16,6.7 28.98,6.52 28.4,6.52 27.06,7.86 25.87,7.86
GND on Top Layer: 12.09,14.59 11.59,14.59 11.54,14.54 11.54,14.59 11.3,14.83 8.14,14.83 8.11,14.87 8.11,16.14 8.68,16.71 10.14,16.71 10.24,16.61 10.24,15.65 10.58,15.31 11.92,15.31 12.23,15 12.23,14.31 12.23,14.3 12.16,14.22 11.96,14.22 11.96,14.46
GND on Top Layer: 0.11,12.61 18.42,12.61 18.42,-0.06 0.11,-0.06
GND on Top Layer: 41.25,6.3 43.45,6.3 44.53,7.37 44.53,10.83 44.14,11.22 44.46,11.54 45.46,11.54 45.57,11.43 45.57,10.26 45.41,10.1 45.41,9.98 45.81,9.58 46.14,9.58 46.65,9.07 46.65,6.56 45.97,5.88 44.43,5.88 44.01,5.46 41.34,5.46 41.25,5.54
GND on Top Layer: 30.8,23.12 32.69,23.12 32.69,20.56 30.8,20.56
GND on Bottom Layer: 0.08,26.63 74.07,26.63 74.07,0 0.08,0
GND on Inner1: 0.08,26.63 0.08,0 74.05,0 74.05,26.63
VCCB on Top Layer: 44.99,12.19 45.48,12.19 45.64,12.02 45.64,9.69 45.84,9.49 46.33,9.49 46.81,9.01 48.62,9.01 48.62,10.08 46.2,12.5 45.42,12.5 45.39,12.47 45.03,12.47 44.99,12.44
VCCB on Inner2: 54.31,20.28 62.88,20.28 62.88,15.96 54.31,15.96
VCCB on Inner2: 43.38,12.66 43.26,12.66 43.26,20.28 54.58,20.28 54.58,13.93 46.03,13.93 46.03,12.51 46.69,11.85 46.69,10.38 45.66,10.38
VCCB on Inner2: 45.17,12.47 46.22,12.47 48.46,10.25 48.46,9.11 46.74,9.08 45.17,10.72 45.15,11.65
VCCB on Inner2: 61.93,18.34 61.93,23.08 68.28,23.08 69.55,21.81 69.55,17.74 66.63,17.74 65.82,16.93 65.82,7.18 65.34,6.69 64.47,6.69 64.14,7.02 64.14,13.17 64.73,13.76 64.73,20.26 67.87,20.26 67.87,21.82 63.08,21.82 63.08,18.36
INT_VERF on Top Layer: 40.75,11.5 40.75,10.78 40.69,10.72 40.03,10.72 40.02,10.73 39.99,10.7 39.99,8.9 40.72,8.16 41.84,8.16 42.36,7.65 42.36,7.6 43.11,6.85 43.11,6.74 43.3,6.55 43.88,6.55 43.94,6.62 43.94,9.51 43.87,9.59 42.94,9.59 42.49,10.04 42.49,11.54 40.8,11.54
INT_VERF on Top Layer: 42.07,13.18 42.12,13.23 44.17,13.23 44.17,12.32 44.17,12.32 43.47,12.32 43.47,12.08 43.21,11.82 42.99,11.5 42.86,10.98 42.86,9.46 42.76,9.36 42.25,9.36 42.07,9.53
JTAG_VREF on Top Layer: 59.65,16.09 60.91,16.09 60.91,14.52 59.65,14.52
JTAG_VREF on Bottom Layer: 65.11,21.68 69.93,21.68 69.93,20.66 65.11,20.66
JTAG_VREF on Inner2: 54.72,14.88 59.41,14.88 59.41,12.96 54.72,12.96
JTAG_VREF on Inner2: 54.69,15.83 64.51,15.83 64.51,13.98 54.69,13.98
JTAG_VREF on Inner2: 59.02,13.83 46.13,13.83 46.13,12.61 59.06,12.75
JTAG_VREF on Inner2: 63.08,15.46 63.08,21.68 67.78,21.68 67.78,20.66 66.89,20.66 66.5,20.28 64.6,20.28 64.6,13.93 61.55,13.93
USB_5V on Top Layer: 11.89,15.96 14.52,15.96 14.52,14.49 11.89,14.49
USB_5V on Inner2: 6.73,17.01 14.78,17.01 14.86,16.92 14.86,16.18 12.92,14.24 12.12,14.24 8.44,10.56 6.73,10.56 6.73,10.57
VCORE on Inner2: 20.16,11.57 14.69,11.61 14.7,9.15 17.77,6.08 30.17,6.08 31.7,7.6 31.7,11.29 32.09,11.68 32.63,11.68 32.78,11.53 32.78,7.16 30.7,5.08 17.08,5.08 13.31,8.85 13.65,13.3 16.73,13.6 20.19,16.22
VCORE on Inner2: 33.09,20.06 32.67,20.48 31.8,20.48 31.43,20.11 31.43,19.91 30.91,19.4 30.05,19.4 29.28,18.62 29.23,18.62 29.23,17.24 28.6,16.61 26.26,16.61 25.37,17.5 25.37,24.76 19.86,24.76 19.86,12.79 18.91,12.79 18.55,12.43 18.55,12.12 20.77,9.9 25.37,9.9 32.03,18.42
$1N3546 on Top Layer: 8.62,11.09 13.23,11.09 13.23,9.91 8.62,9.91

Small or netless copper shapes (teardrops, artwork), in the pictures only: 262 on Top Layer, 41 on Bottom Layer

## Text on the board
Bottom Silkscreen Layer: 1 | 0 | GND | TXD | 2V5 | 1V8 | 3V3 | DOWN | UP | BOARG / VERF | JTAG / VERF | VREF | TMS | TCK | TDO | TDI | NC | 🍐🍏🍑 | 🍉🍈🍇🥥 | 🥝🫐🍅🫒 | 🍊🍋🍌🍋‍🟩 | 🍍🥭🍓🍒 | 🍐🍏🍑🍎
Top Silkscreen Layer: 1 | 0 | RXD | VREF | 3V3 | TXD | 2V5 | 1V8 | RF/IMPCAS
